# Altium project H2_transmitter_v1.PrjPcb
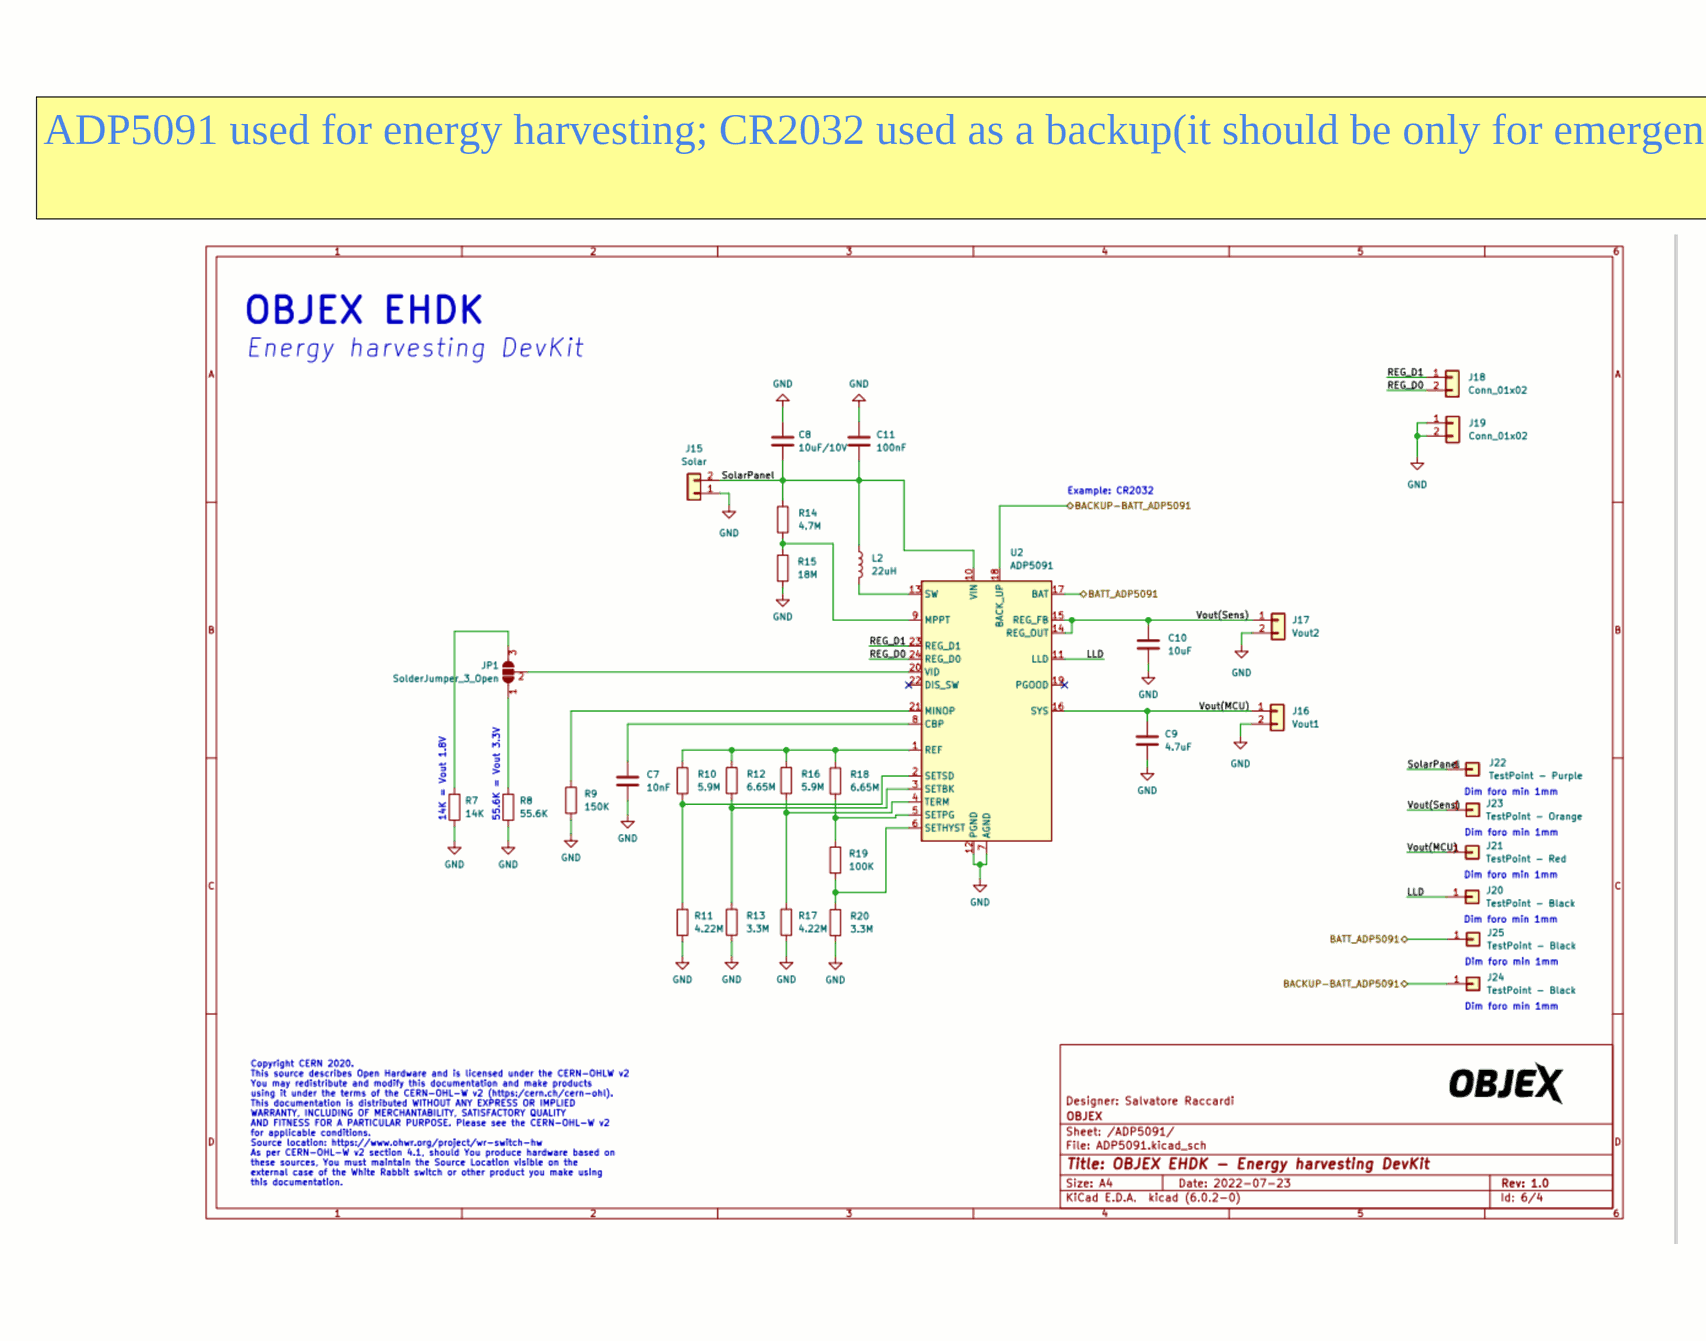
[diagram p0: 1_Power.SchDoc, left]
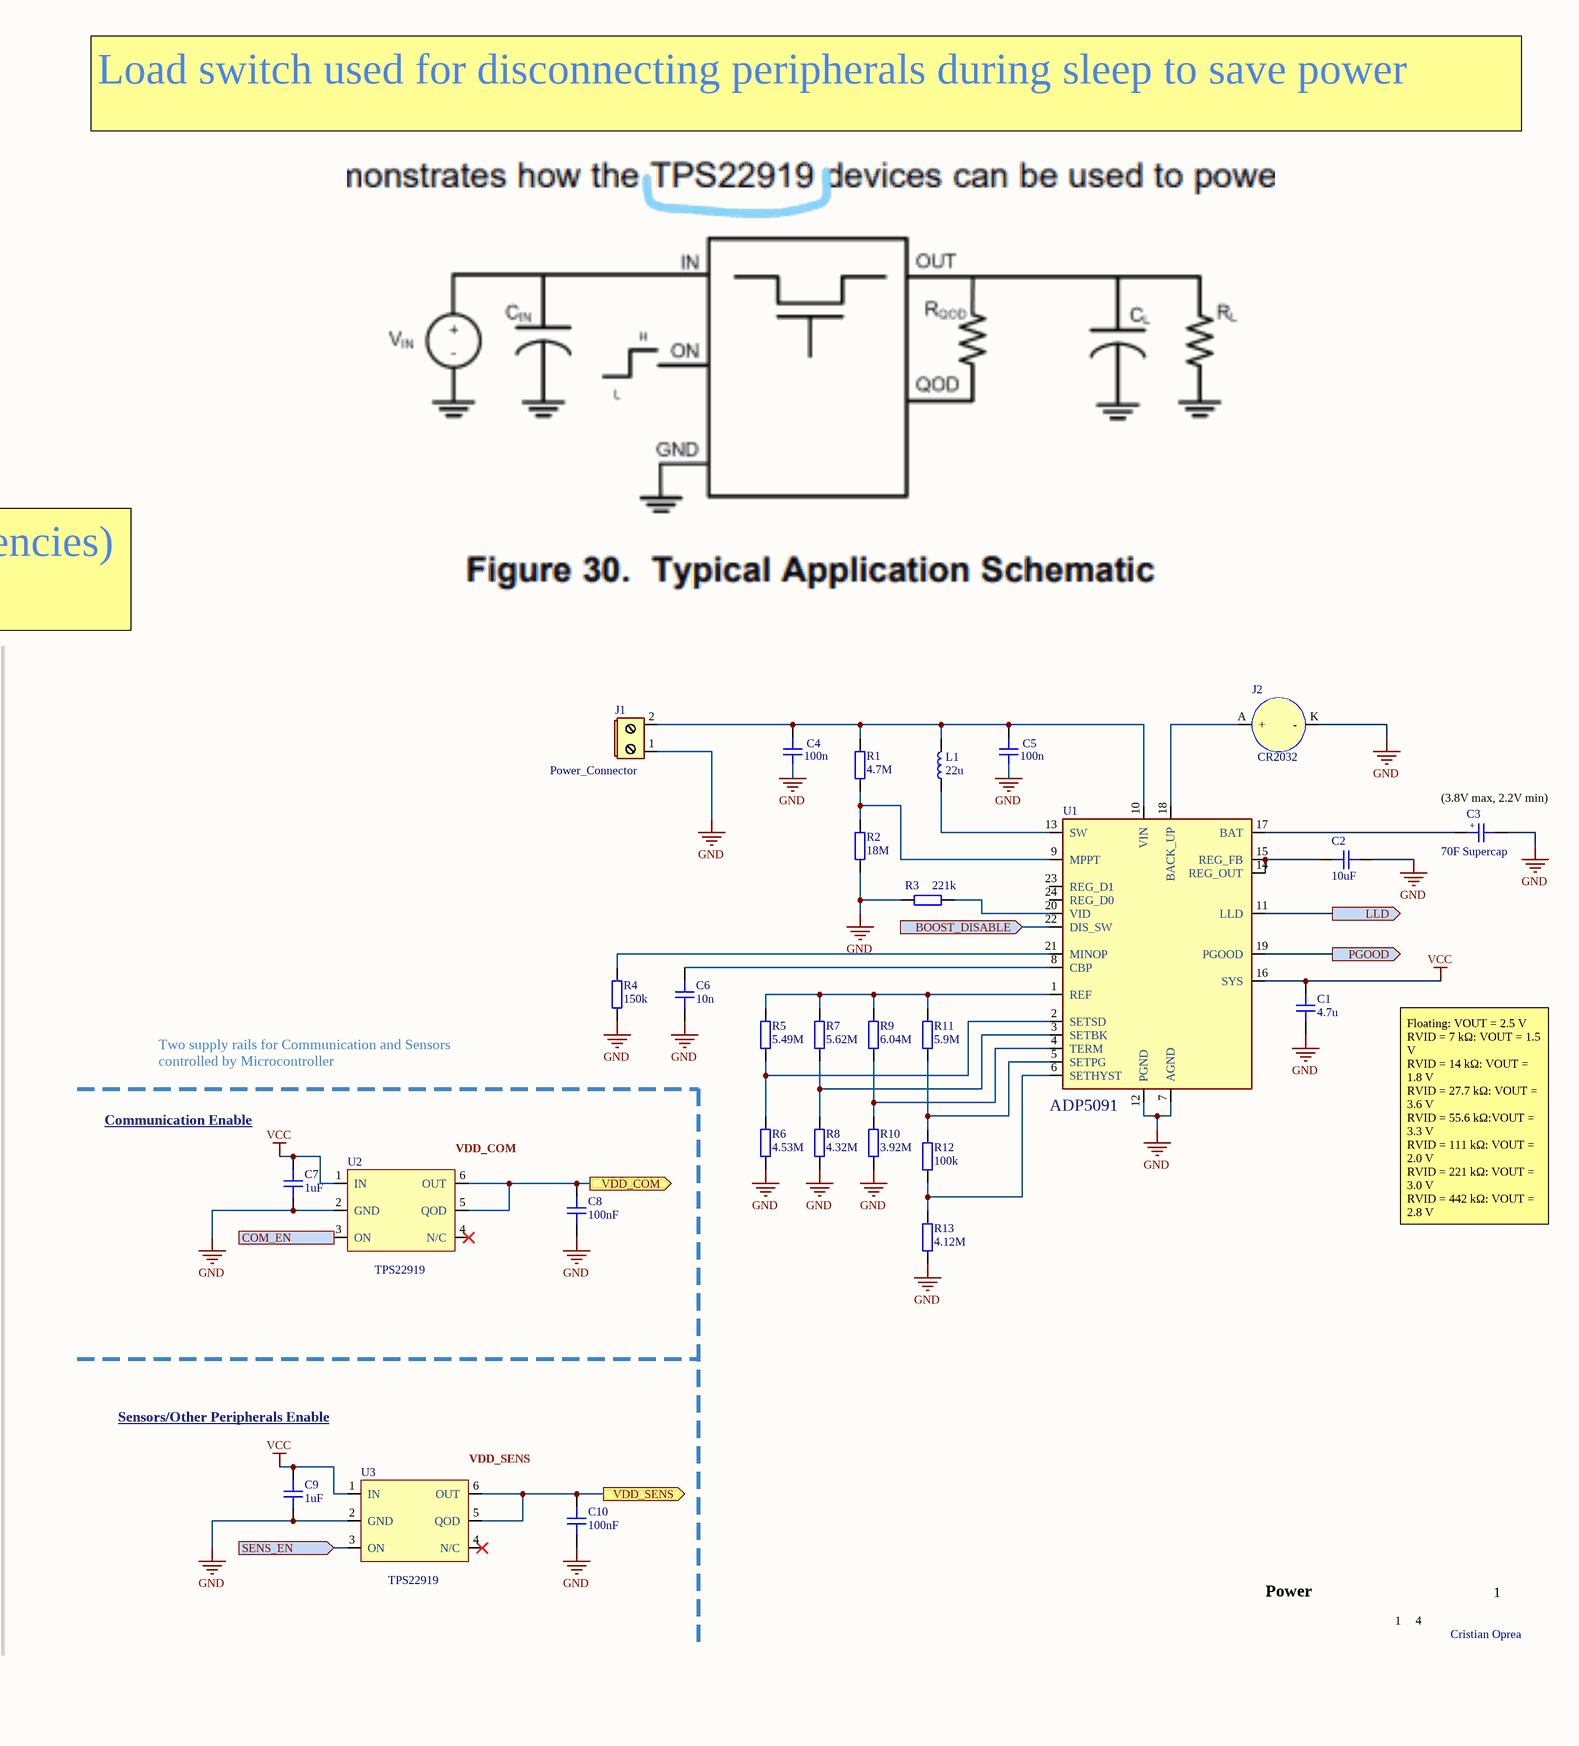
[diagram p1: 1_Power.SchDoc, middle]
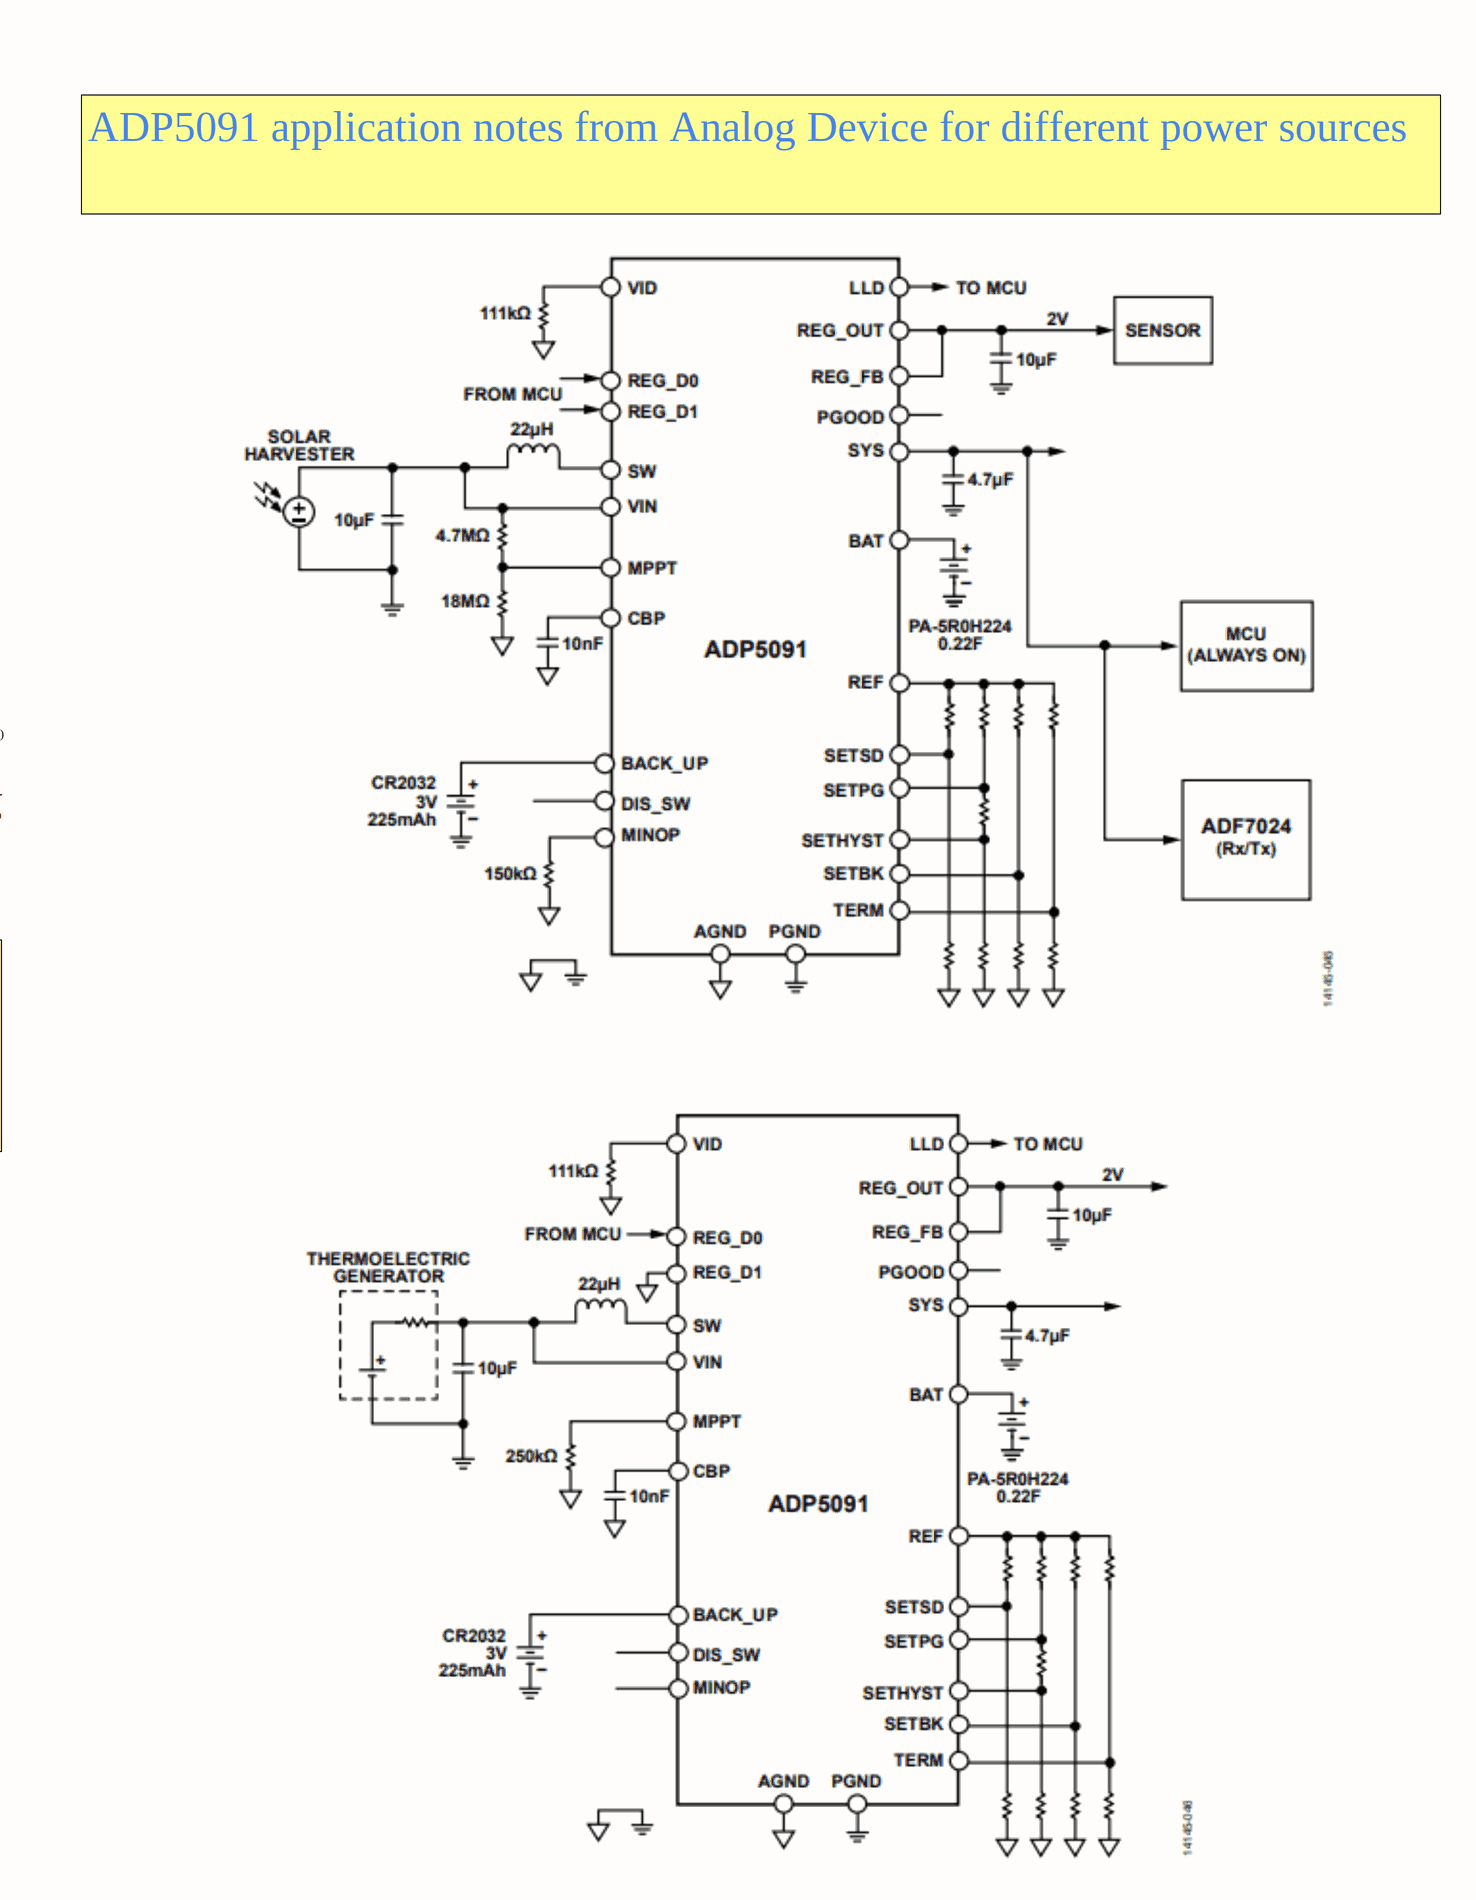
[diagram p2: 1_Power.SchDoc, right]
4 sheets, 53 parts. Net scope: flat (ports and power ports of the same name join across sheets).
Sheets:
  1_Power.SchDoc
  2_Microcontroler.SchDoc
  3_Communication.SchDoc
  4_Modules.SchDoc

## Sheet 1_Power.SchDoc
size A4; SheetNumber: 1; SheetTotal: 4

### Parts
(Parts that share a designator on the sheet are numbered #1, #2 ... from top to bottom, then left to right.)
C1  4.7u  [CAP_0603]
C2  10uF  [CAP_0603]
C3  70F Supercap  [CAP_TANT_0603]
C4  100n  [CAP_0603]
C5  100n  [CAP_0603]
C6  10n  [CAP_0603]
C7  1uF  [CAP_0603]
C8  100nF  [CAP_0603]
C9  1uF  [CAP_0603]
C10  100nF  [CAP_0603]
J1  Power_Connector
J2#1  CR2032  [CR2032]
L1  22u  [IND_1008]
R1  4.7M  [RES_0603]
R2  18M  [RES_0603]
R3  221k  [RES_0603]
R4  150k  [RES_0603]
R5  5.49M  [RES_0603]
R6  4.53M  [RES_0603]
R7  5.62M  [RES_0603]
R8  4.32M  [RES_0603]
R9  6.04M  [RES_0603]
R10  3.92M  [RES_0603]
R11  5.9M  [RES_0603]
R12  100k  [RES_0603]
R13  4.12M  [RES_0603]
U1  ADP5091
U2  TPS22919
U3  TPS22919

### Ports
BOOST_DISABLE (in), COM_EN (in), LLD (out), PGOOD (out), SENS_EN (in), VDD_COM (out), VDD_SENS (out)

### Nets
GND: C1.1 C2.2 C3.K C4.1 C5.1 C6.1 C7.1 C8.1 C9.1 C10.1 J1.1 J2#1.K(-) R2.1 R3.1 R4.1 R6.1 R8.1 R10.1 R13.1 U1.7(AGND) U1.12(PGND) U2.2(GND) U3.2(GND)
VCC: C1.2 C7.2 C9.2 U1.16(SYS) U2.1(IN) U3.1(IN)
NetC2_1: C2.1 U1.14(REG_OUT) U1.15(REG_FB)
NetC3_A: C3.A U1.17(BAT)
NetC4_2: C4.2 C5.2 J1.2 L1.2 R1.2 U1.10(VIN)
NetC6_2: C6.2 U1.8(CBP)
NetC8_2: C8.2 U2.5(QOD) U2.6(OUT) ; port VDD_COM
NetC10_2: C10.2 U3.5(QOD) U3.6(OUT) ; port VDD_SENS
NetJ2#1_A: J2#1.A(+) U1.18(BACK_UP)
NetL1_1: L1.1 U1.13(SW)
NetR1_1: R1.1 R2.2 U1.9(MPPT)
NetR3_2: R3.2 U1.20(VID)
NetR4_2: R4.2 U1.21(MINOP)
NetR5_1: R5.1 R6.2 U1.2(SETSD)
NetR5_2: R5.2 R7.2 R9.2 R11.2 U1.1(REF)
NetR7_1: R7.1 R8.2 U1.3(SETBK)
NetR9_1: R9.1 R10.2 U1.4(TERM)
NetR11_1: R11.1 R12.2 U1.5(SETPG)
NetR12_1: R12.1 R13.2 U1.6(SETHYST)
NetU1_11: U1.11(LLD) ; port LLD
NetU1_19: U1.19(PGOOD) ; port PGOOD
NetU1_22: U1.22(DIS_SW) ; port BOOST_DISABLE
NetU2_3: U2.3(ON) ; port COM_EN
NetU3_3: U3.3(ON) ; port SENS_EN

Not connected (* = marked no-connect by the designer): U1 23(REG_D1) 24(REG_D0); U2 4(N/C)*; U3 4(N/C)*

### Notes on the sheet
- Load switch used for disconnecting peripherals during sleep to save power
- ADP5091 application notes from Analog Device for different power sources
- ADP5091 used for energy harvesting; CR2032 used as a backup(it should be only for emergencies)
- R1 not populated for TEG generators
- (near C3) (3.8V max, 2.2V min)
- VID resistor for setting output voltage
- Low Light Density (low voltage at input), PGOOD is HIGH only when output voltage is higher than the set voltage
- Two supply rails for Communication and Sensors controlled by Microcontroller
- Communication Enable
- (near U2) VDD_COM
- Vsetsd = 2.2V (stop discharge threshold) (hybrid supercapacitor with lithium)
- Vsetbk = 2.3V (backup supply swith on threshold)(higher than stop discharge threshold)
- (near R12) Vbat_term = 3.8V (stop charge threshold) (hybrid supercapacitor with lithium)
- (near R12) Vsetbkhys = (hysteresis threshold)
- Floating: VOUT = 2.5 V
  RVID = 7 kΩ: VOUT = 1.5 V
  RVID = 14 kΩ: VOUT = 1.8 V
  RVID = 27.7 kΩ: VOUT = 3.6 V
  RVID = 55.6 kΩ:VOUT = 3.3 V
  RVID = 111 kΩ: VOUT = 2.0 V
  RVID = 221 kΩ: VOUT = 3.0 V
  RVID = 442 kΩ: VOUT = 2.8 V
- (near R13) Vsetpg = 2.4V (power good threshold) (voltage output is higher than this threshold)
- Sensors/Other Peripherals Enable
- (near U3) VDD_SENS
- Power
- 1
- 4
- Cristian Oprea
- (in symbol Supercapacitor) +

### Library data of the parts
C1 C2 C4-C10 = CAP_0603: Capacitor SMD 0603; Manufacturer: *; Manufacturer Part Number: *; Distributor Link: *; LCSC: *; Rating: *; Dielectric: *
C3 = Supercapacitor: Manufacturer: *; Manufacturer Part Number: *; Distributor Link: *; LCSC: *
J1 = Power_Connector: Screw terminal or plug terminal for power
J2#1 = CR2032-BS-6-1: CR2032 Coin Cell Battery Holder; Manufacturer: Q&J; Manufacturer Part Number: CR2032-BS-6-1
L1 = IND_1008: Inductor SMD 1008
R1-R13 = RES_0603: Resistor SMD 0603; Manufacturer: *; Manufacturer Part Number: *; Distributor Link: *; LCSC: *
U1 = ADP5091: Ultralow Power Energy Harvester PMUs / with MPPT and Charge Management and BAckup Supply
U2 U3 = TPS22919: 5.5-V, 1.5-A, 90-mΩ load switch with adjustable output discharge

## Sheet 2_Microcontroler.SchDoc
size A4; SheetNumber: 2; SheetTotal: 4
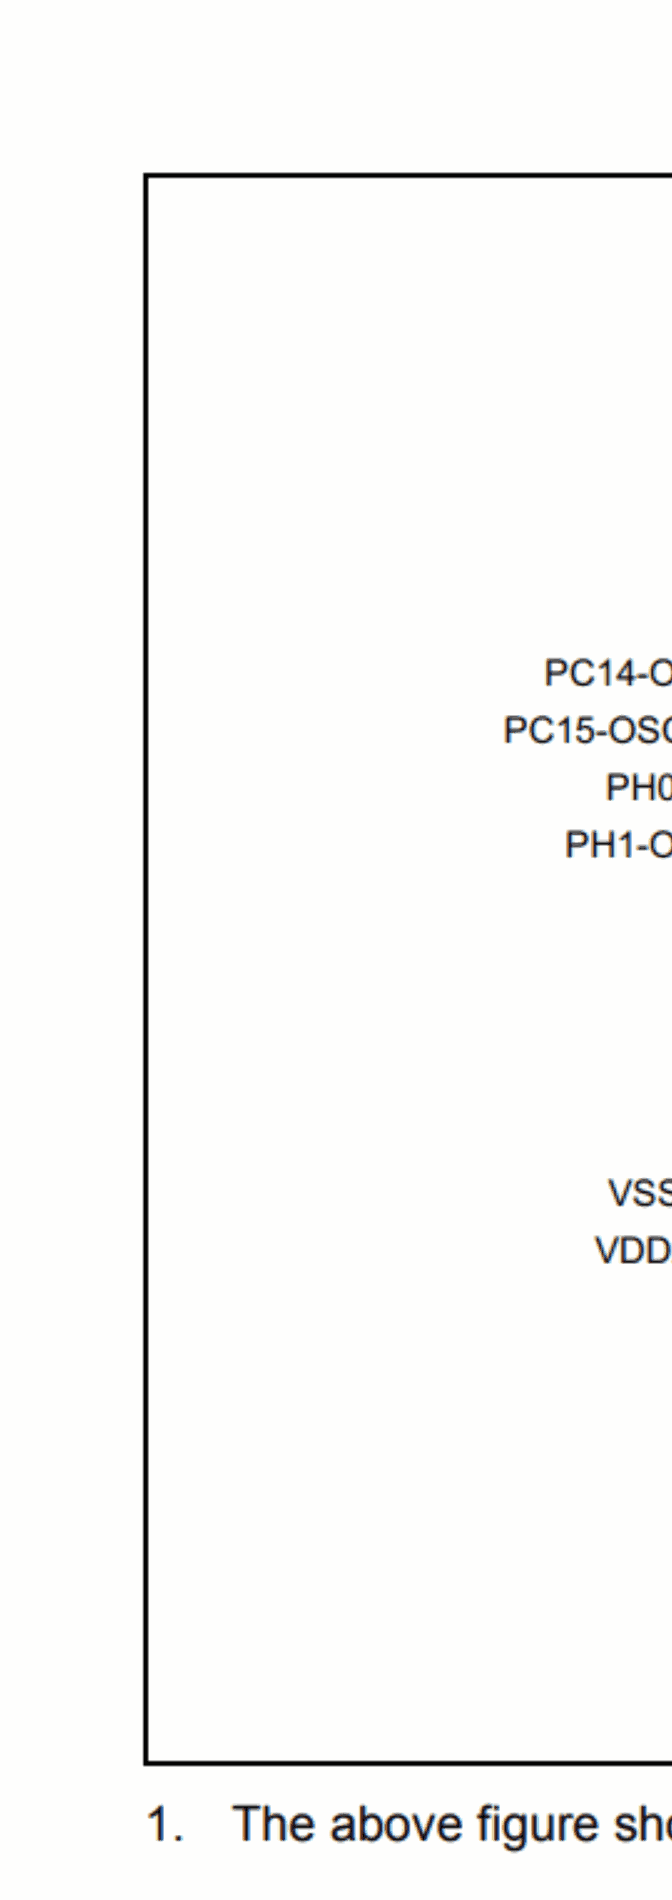
[diagram p3: 2_Microcontroler.SchDoc, top left]
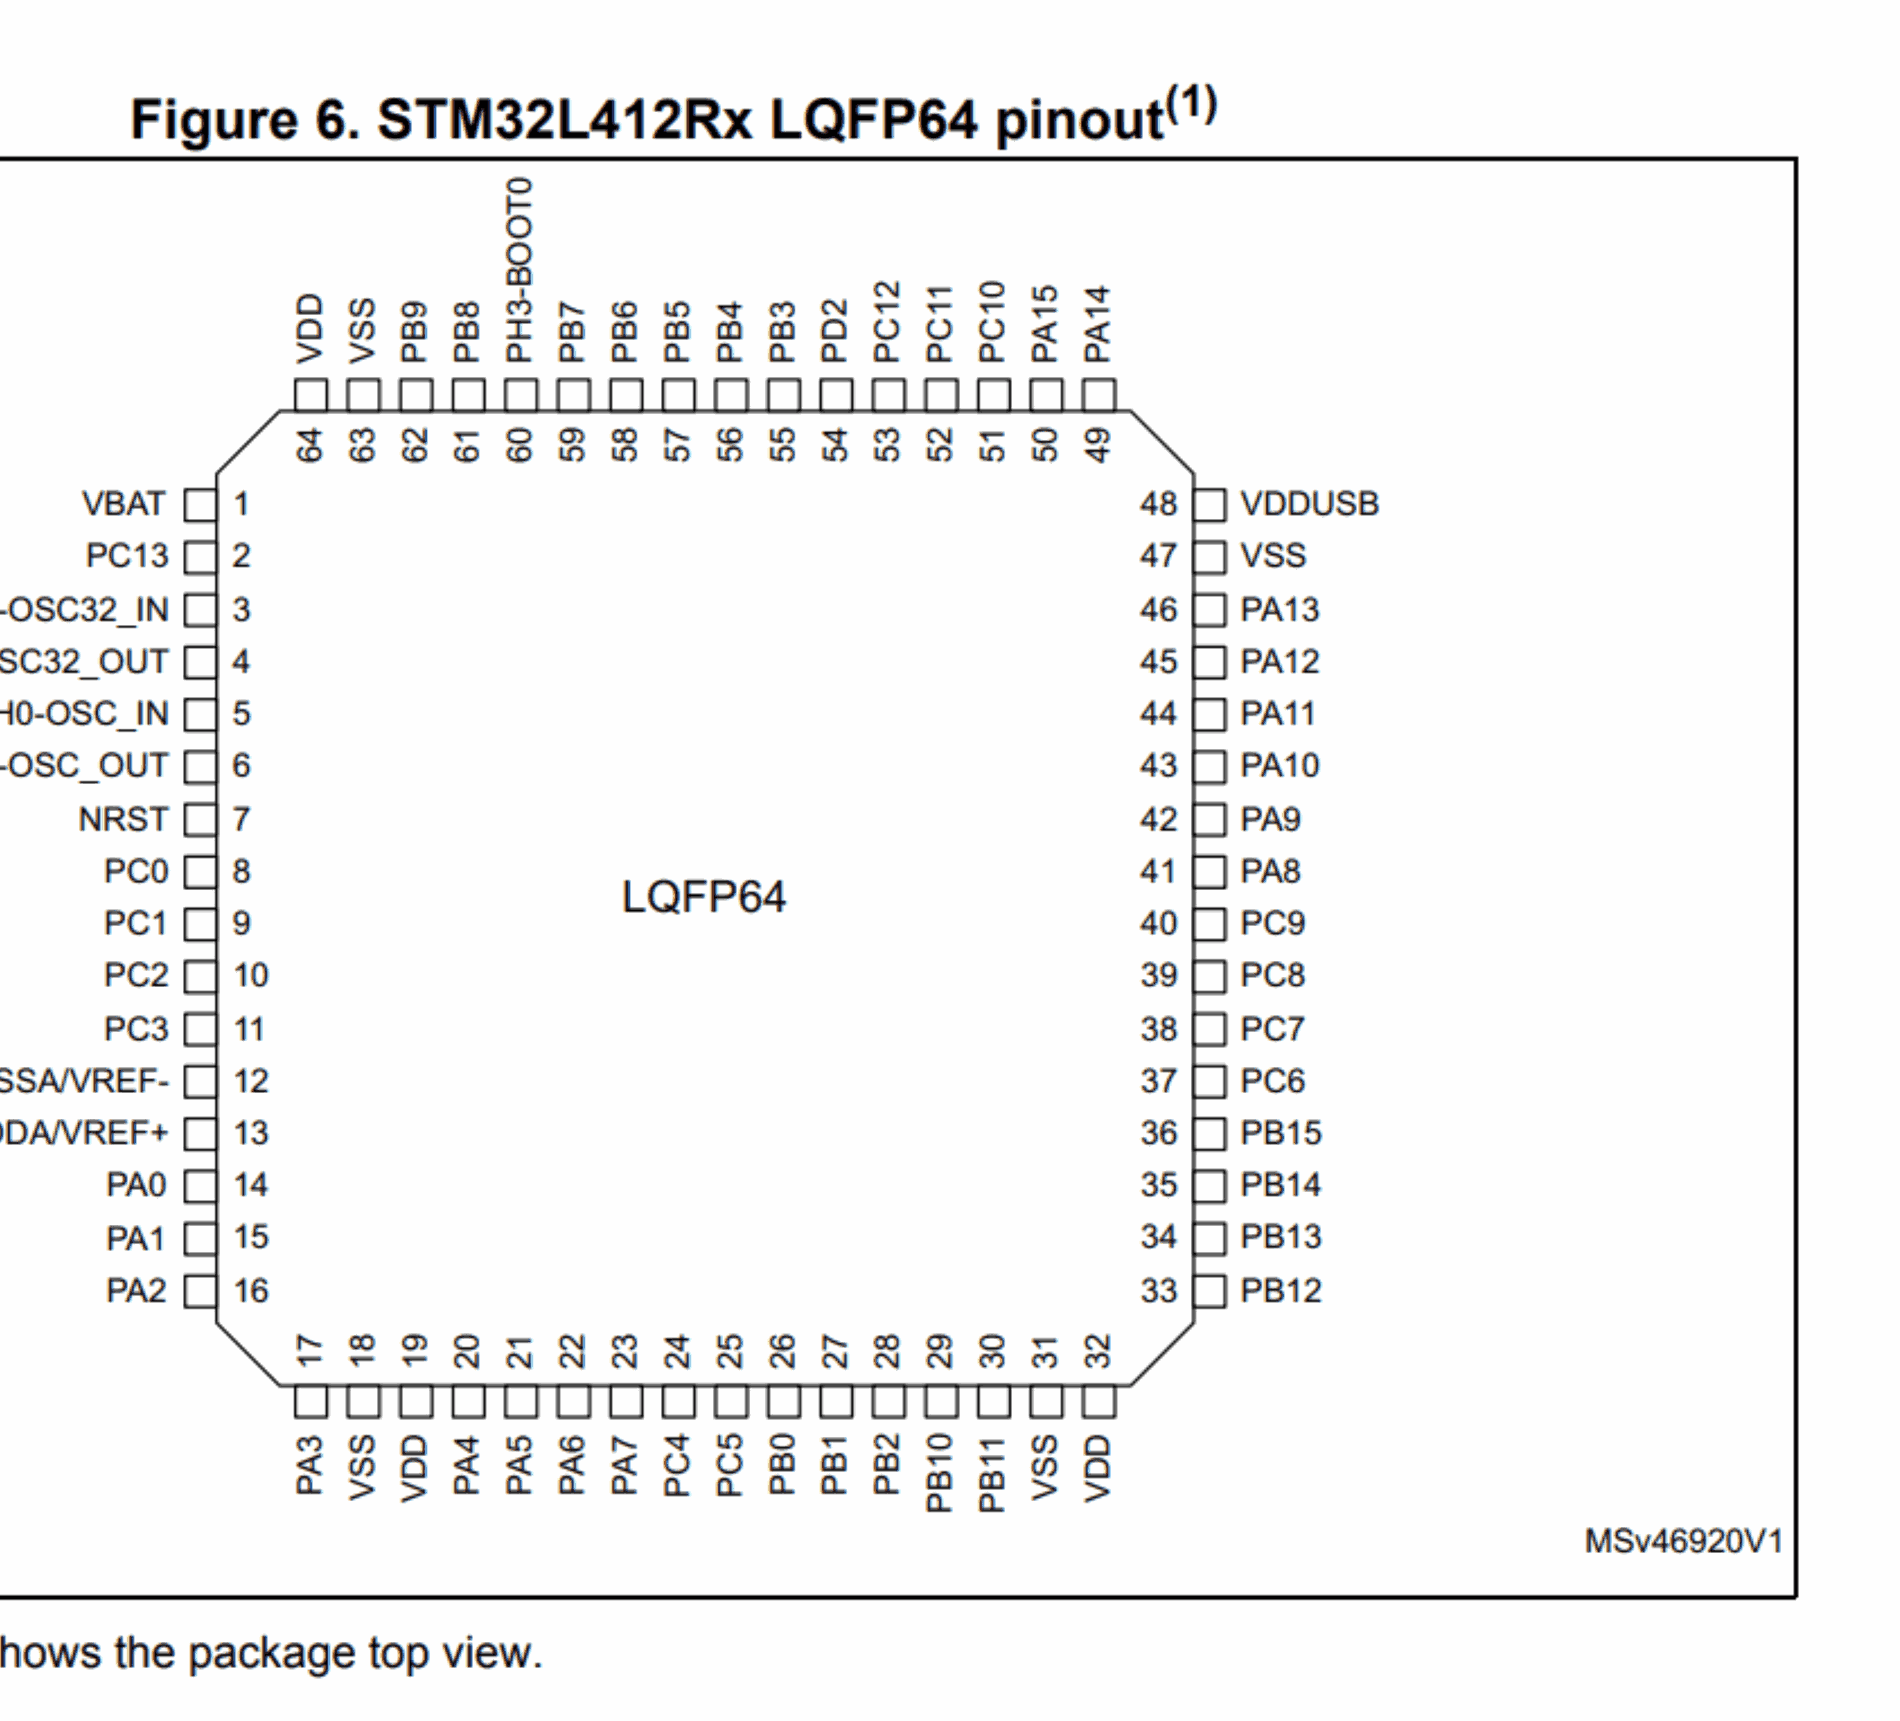
[diagram p4: 2_Microcontroler.SchDoc, top middle]
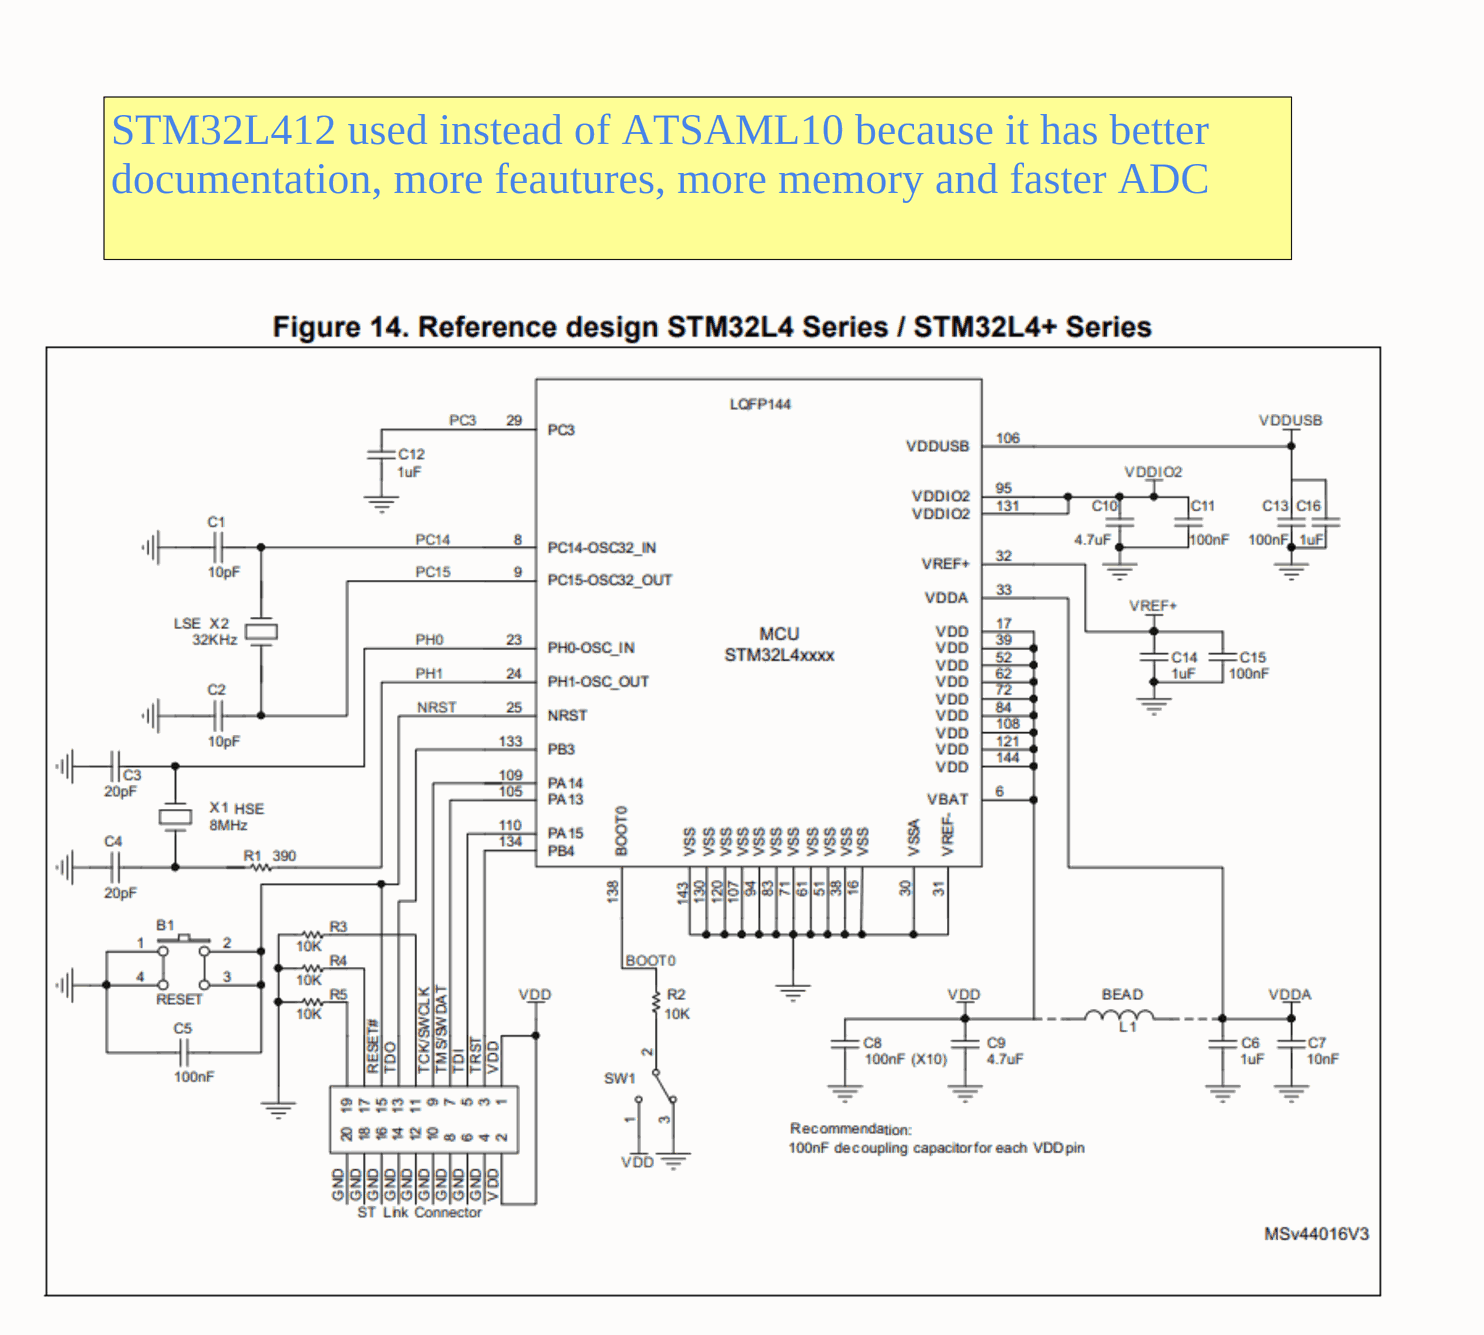
[diagram p5: 2_Microcontroler.SchDoc, bottom left]
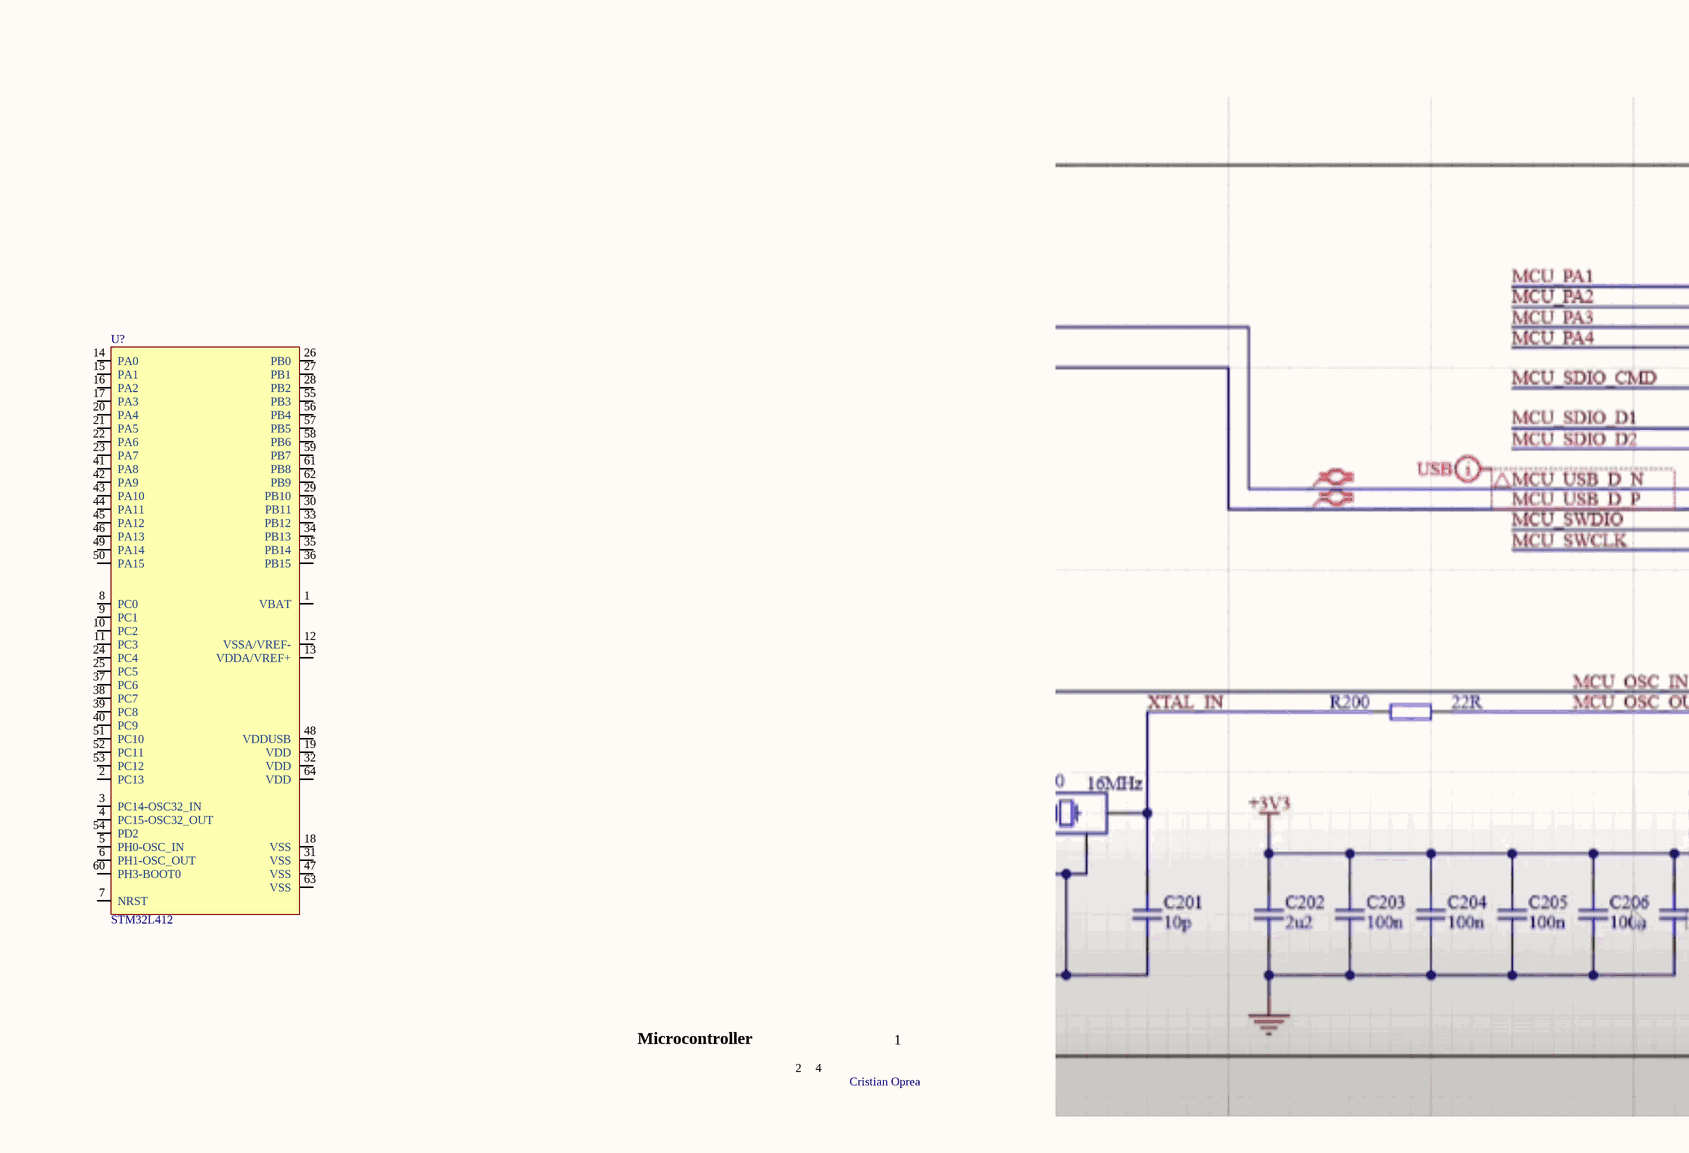
[diagram p6: 2_Microcontroler.SchDoc, bottom middle]
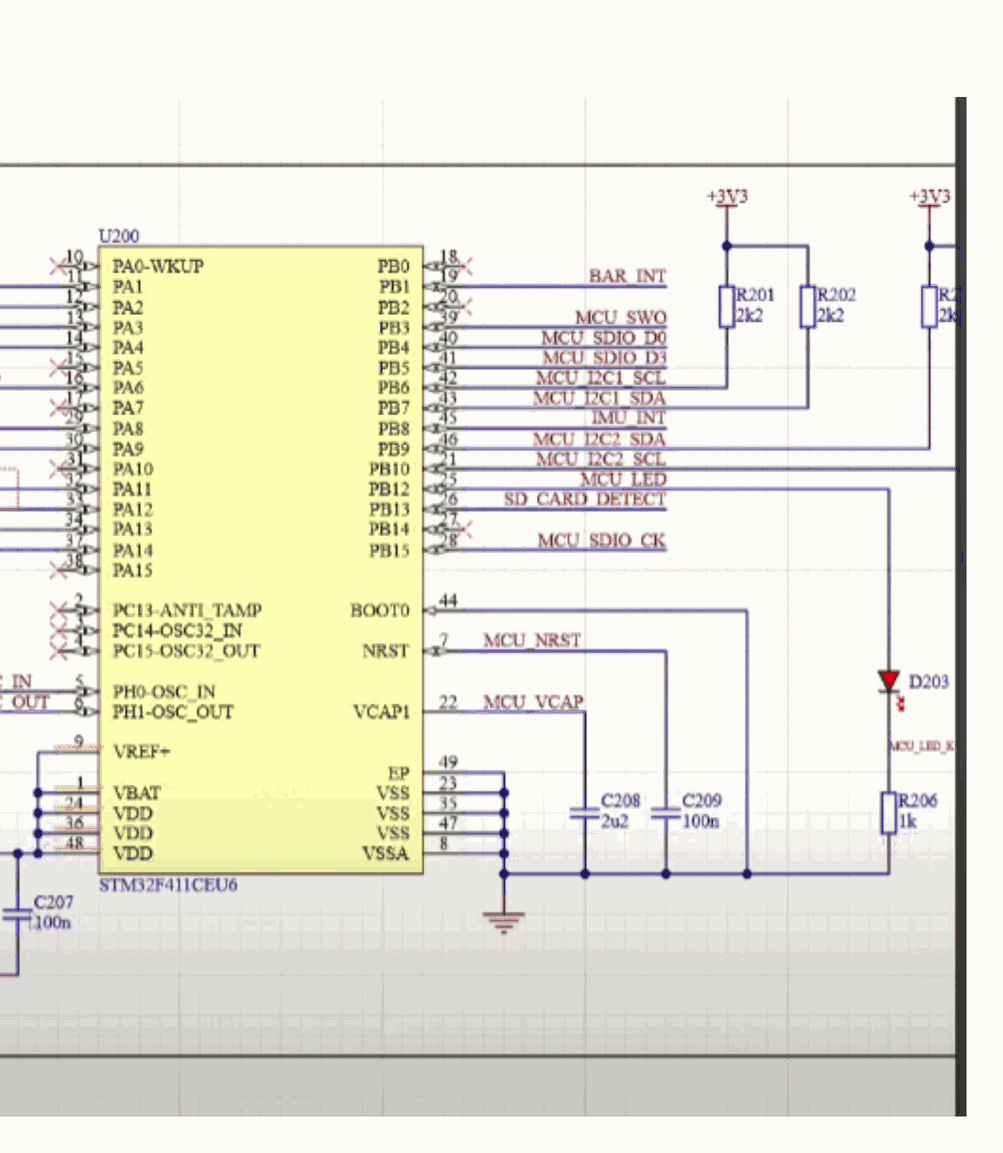
[diagram p7: 2_Microcontroler.SchDoc, bottom right]

### Parts
U?  STM32L412

### Nets

Not connected (* = marked no-connect by the designer): U? 1(VBAT) 2(PC13) 3(PC14-OSC32_IN) 4(PC15-OSC32_OUT) 5(PH0-OSC_IN) 6(PH1-OSC_OUT) 7(NRST) 8(PC0) 9(PC1) 10(PC2) 11(PC3) 12(VSSA/VREF-) 13(VDDA/VREF+) 14(PA0) 15(PA1) 16(PA2) 17(PA3) 18(VSS) 19(VDD) 20(PA4) 21(PA5) 22(PA6) 23(PA7) 24(PC4) 25(PC5) 26(PB0) 27(PB1) 28(PB2) 29(PB10) 30(PB11) 31(VSS) 32(VDD) 33(PB12) 34(PB13) 35(PB14) 36(PB15) 37(PC6) 38(PC7) 39(PC8) 40(PC9) 41(PA8) 42(PA9) 43(PA10) 44(PA11) 45(PA12) 46(PA13) 47(VSS) 48(VDDUSB) 49(PA14) 50(PA15) 51(PC10) 52(PC11) 53(PC12) 54(PD2) 55(PB3) 56(PB4) 57(PB5) 58(PB6) 59(PB7) 60(PH3-BOOT0) 61(PB8) 62(PB9) 63(VSS) 64(VDD)

### Notes on the sheet
- STM32L412 used instead of ATSAML10 because it has better documentation, more feautures, more memory and faster ADC
- Microcontroller
- 2
- 4
- 1
- Cristian Oprea

### Library data of the parts
U? = STM32L412: Ultra-low-power Arm® Cortex®-M4 32-bit MCU+FPU, 100DMIPS, / up to 128KB flash, 40KB SRAM(LQFP64)

## Sheet 3_Communication.SchDoc
size A4; SheetNumber: 3; SheetTotal: 4
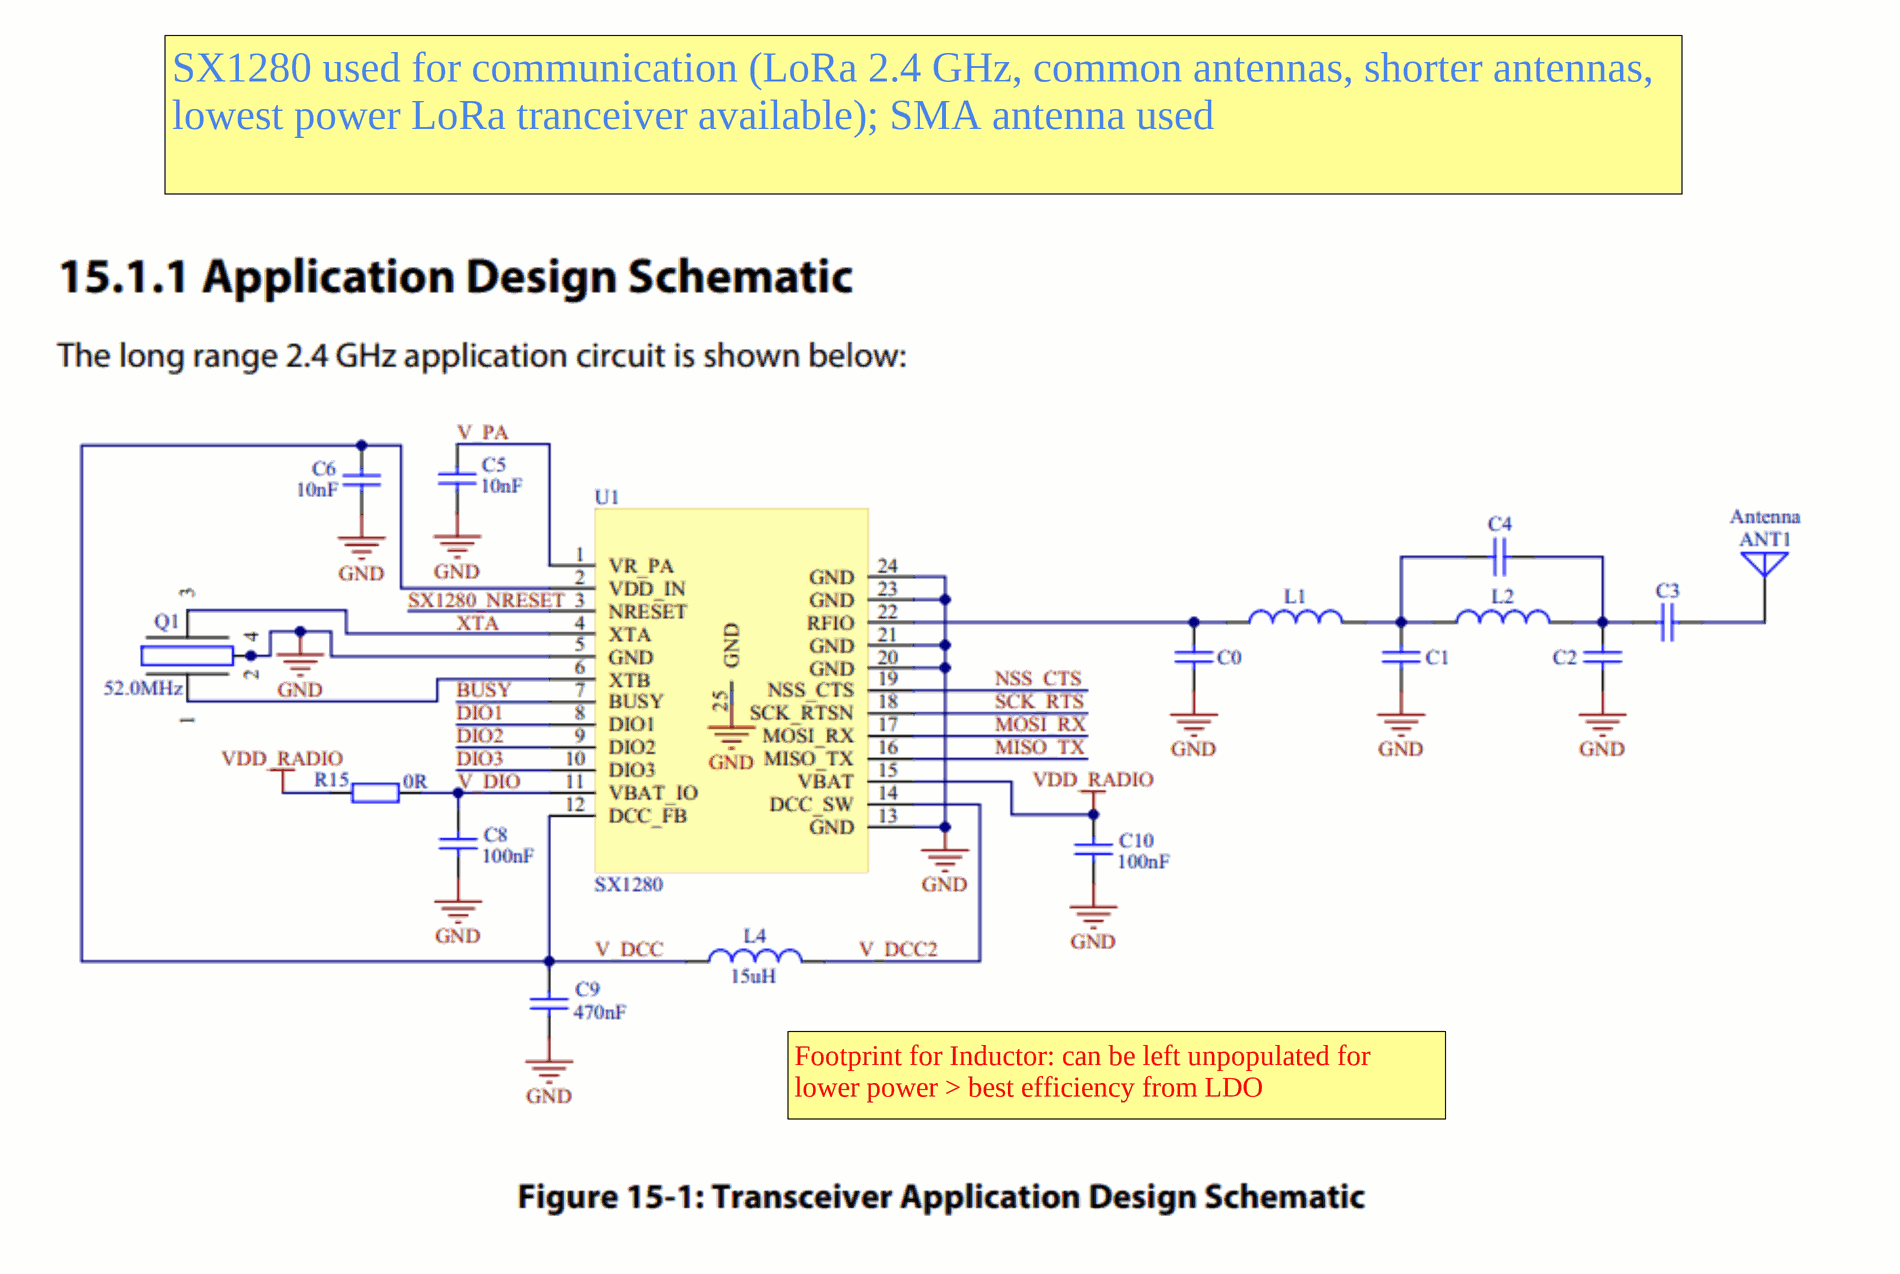
[diagram p8: 3_Communication.SchDoc, left]
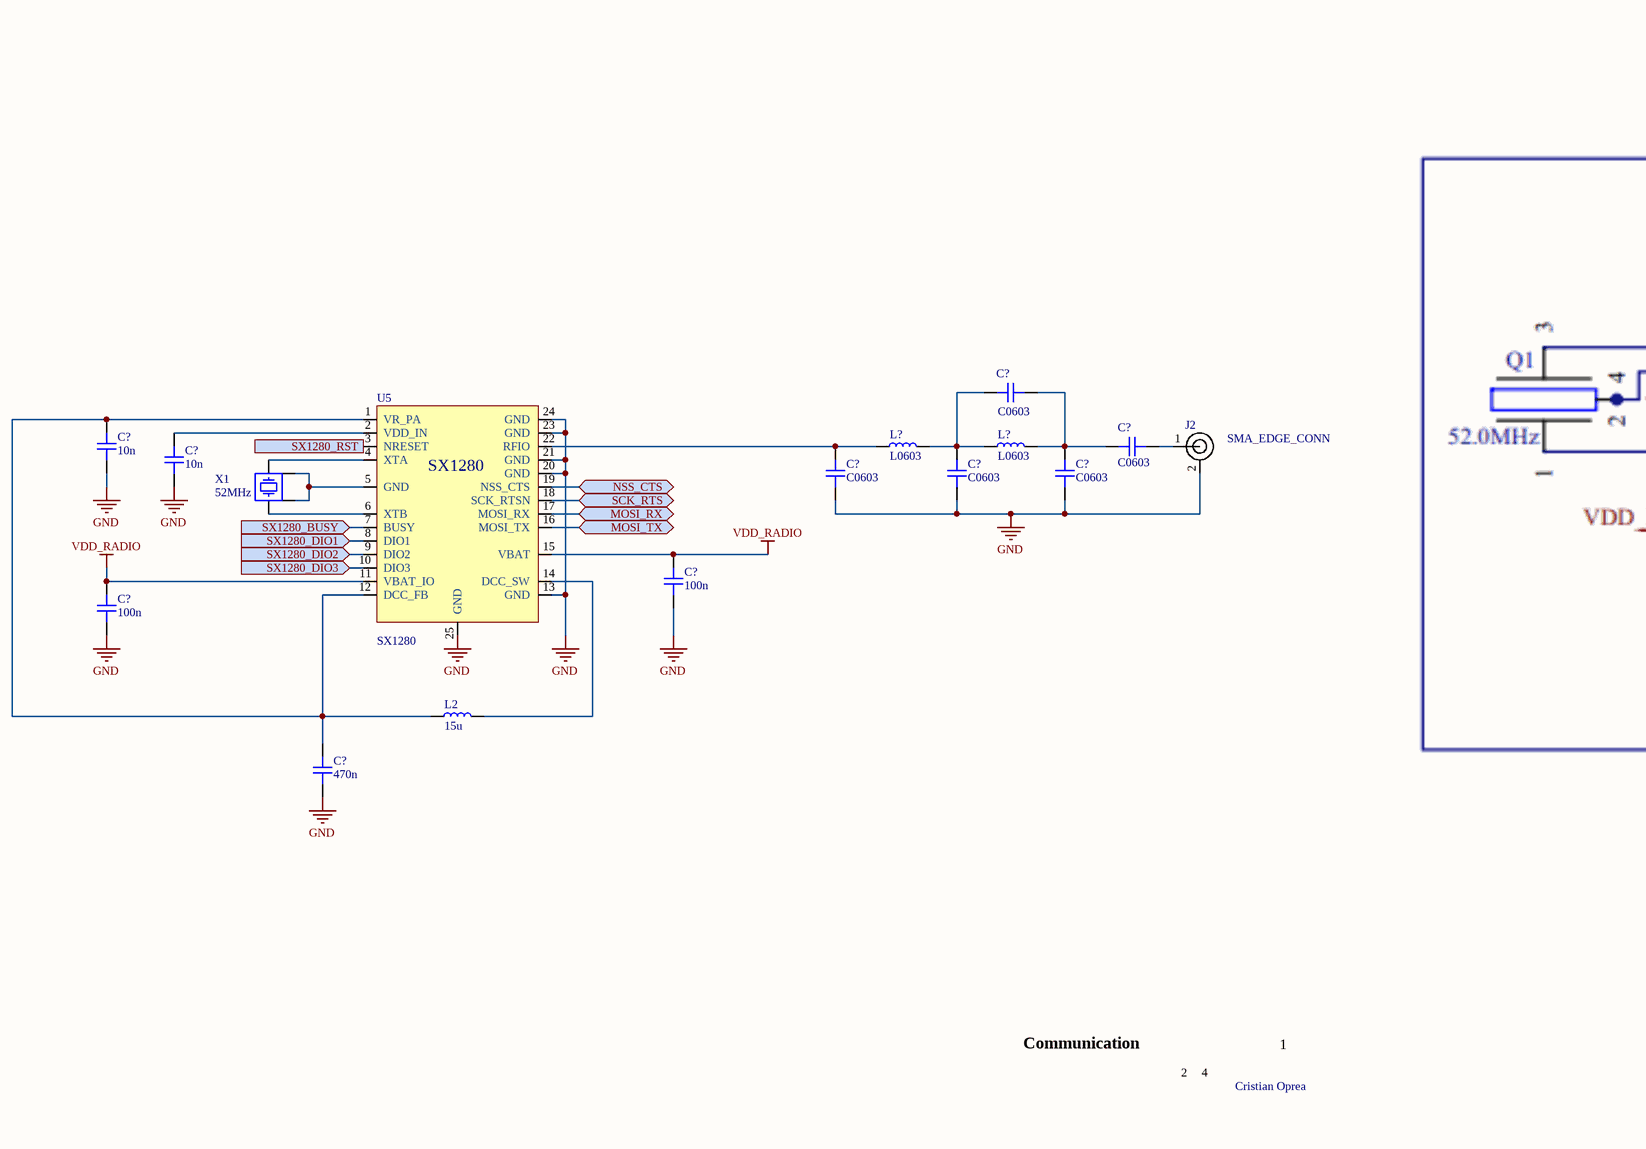
[diagram p9: 3_Communication.SchDoc, middle]
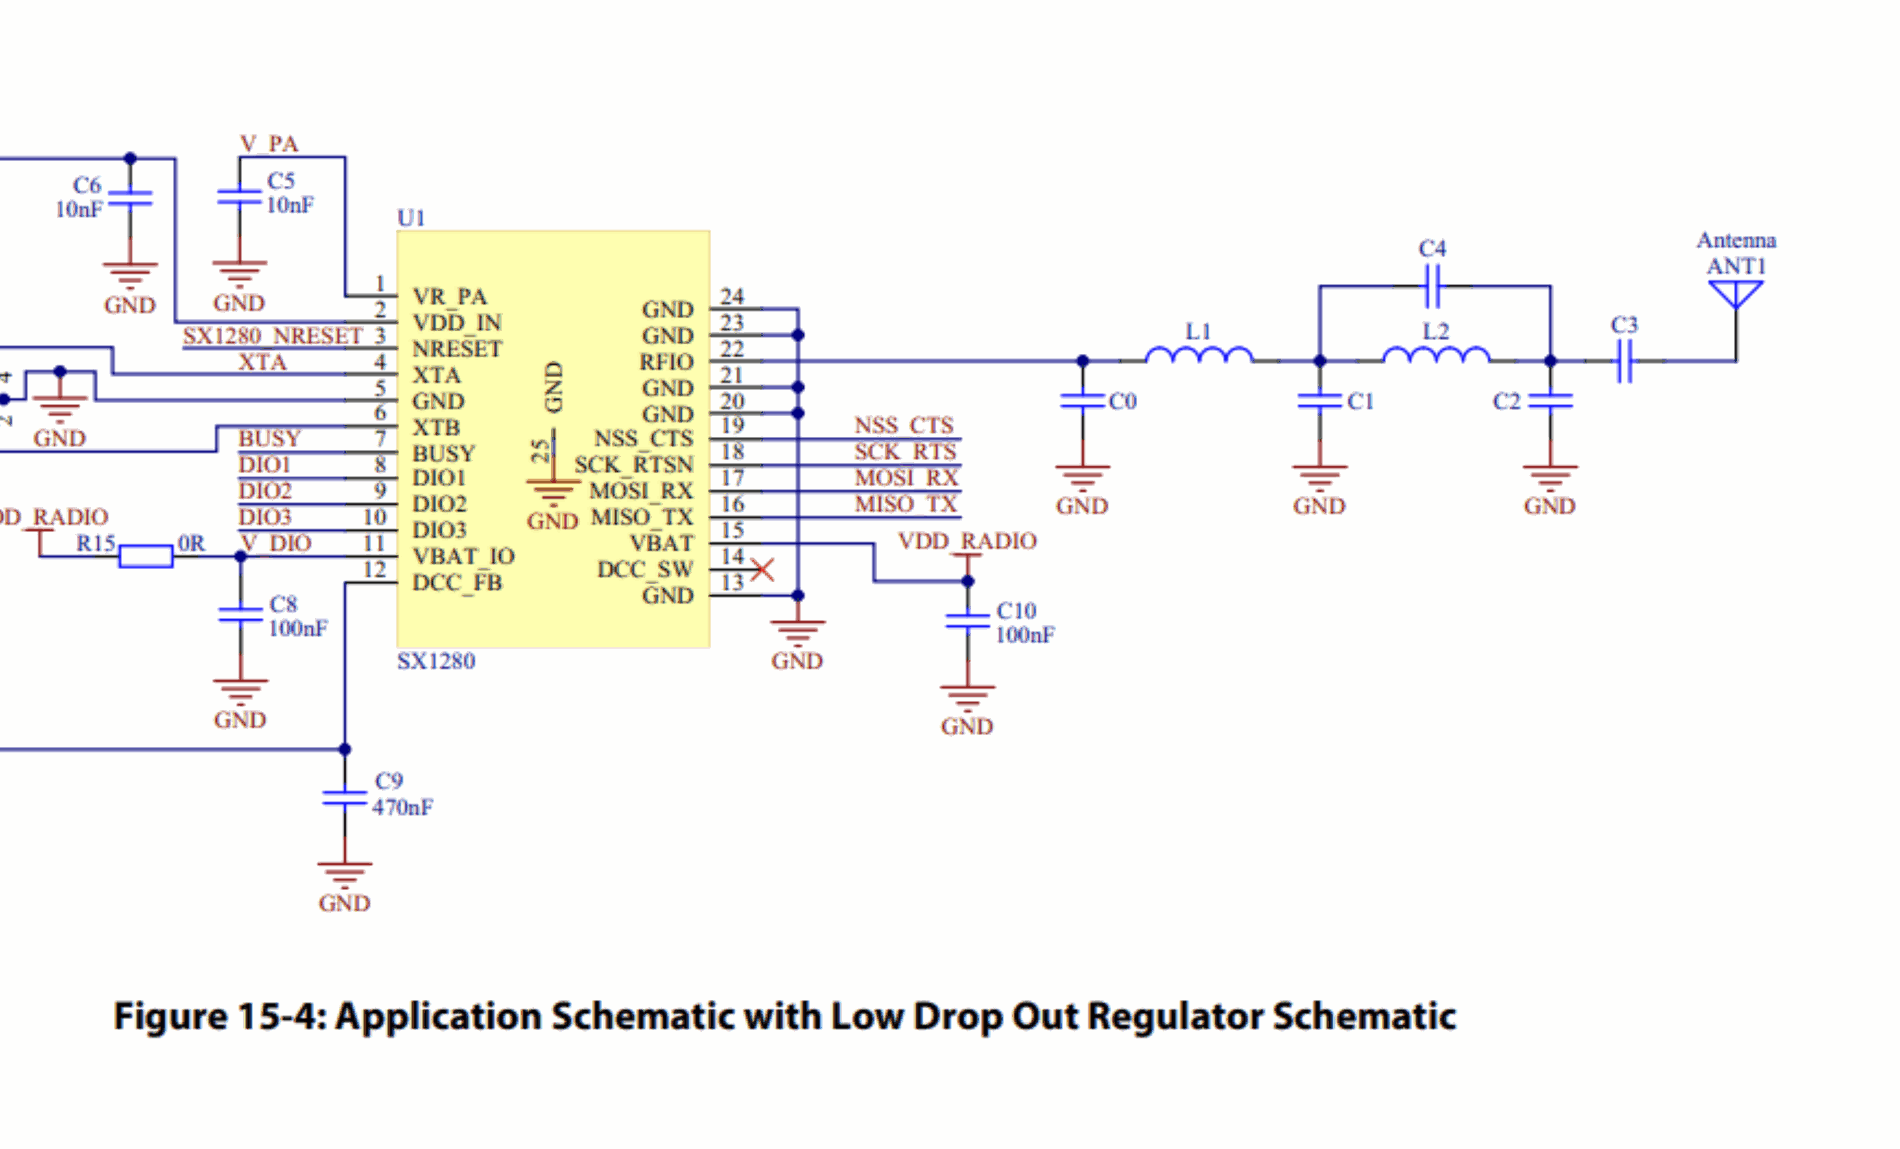
[diagram p10: 3_Communication.SchDoc, right]

### Parts
(Parts that share a designator on the sheet are numbered #1, #2 ... from top to bottom, then left to right.)
C?#1  C0603  [CAP_0603]
C?#2  10n  [CAP_0603]
C?#3  C0603  [CAP_0603]
C?#4  10n  [CAP_0603]
C?#5  C0603  [CAP_0603]
C?#6  C0603  [CAP_0603]
C?#7  C0603  [CAP_0603]
C?#8  100n  [CAP_0603]
C?#9  100n  [CAP_0603]
C?#10  470n  [CAP_0603]
J2#2  SMA_EDGE_CONN  [CON-SMA-EDGE-S]
L2  15u  [IND_0603]
L?#1  L0603  [IND_0603]
L?#2  L0603  [IND_0603]
U5  SX1280
X1  52MHz  [XTAL_3225]

### Ports
MOSI_RX (bidir), MOSI_TX (bidir), NSS_CTS (bidir), SCK_RTS (bidir), SX1280_BUSY (in), SX1280_DIO1 (in), SX1280_DIO2 (in), SX1280_DIO3 (in), SX1280_RST (in)

### Nets
GND: C?#2.1 C?#4.1 C?#5.1 C?#6.1 C?#7.1 C?#8.1 C?#9.1 C?#10.1 J2#2.2 U5.13(GND) U5.20(GND) U5.21(GND) U5.23(GND) U5.24(GND) U5.25(GND)
VDD_RADIO: C?#8.2 C?#9.2 U5.11(VBAT_IO) U5.15(VBAT)
NetC?#1_1: C?#1.1 C?#3.2 C?#7.2 L?#2.2
NetC?#1_2: C?#1.2 C?#6.2 L?#1.2 L?#2.1
NetC?#2_2: C?#2.2 C?#10.2 L2.1 U5.1(VR_PA) U5.12(DCC_FB)
NetC?#3_1: C?#3.1 J2#2.1
NetC?#4_2: C?#4.2 U5.2(VDD_IN)
NetC?#5_2: C?#5.2 L?#1.1 U5.22(RFIO)
NetL2_2: L2.2 U5.14(DCC_SW)
NetU5_3: U5.3(NRESET) ; port SX1280_RST
NetU5_4: U5.4(XTA) X1.3
NetU5_5: U5.5(GND) X1.2 X1.4
NetU5_6: U5.6(XTB) X1.1
NetU5_7: U5.7(BUSY) ; port SX1280_BUSY
NetU5_8: U5.8(DIO1) ; port SX1280_DIO1
NetU5_9: U5.9(DIO2) ; port SX1280_DIO2
NetU5_10: U5.10(DIO3) ; port SX1280_DIO3
NetU5_16: U5.16(MOSI_TX) ; port MOSI_TX
NetU5_17: U5.17(MOSI_RX) ; port MOSI_RX
NetU5_18: U5.18(SCK_RTSN) ; port SCK_RTS
NetU5_19: U5.19(NSS_CTS) ; port NSS_CTS

### Notes on the sheet
- SX1280 used for communication (LoRa 2.4 GHz, common antennas, shorter antennas, lowest power LoRa tranceiver available); SMA antenna used
- Values based on antenna input imedance
- Footprint for Inductor: can be left unpopulated for lower power > best efficiency from LDO
- Communication
- 2
- 4
- 1
- Cristian Oprea

### Library data of the parts
C?#1-C?#10 = CAP_0603: Capacitor SMD 0603; Manufacturer: *; Manufacturer Part Number: *; Distributor Link: *; LCSC: *; Rating: *; Dielectric: *
J2#2 = CON-SMA-EDGE-S: RF Connector SMA Female 50 Ohms 18 GHz PCB Edge Mount; Manufacturer: RF Solutions; Manufacturer Part Number: CON-SMA-EDGE-S
L2 L?#1 L?#2 = IND_0603: Inductor SMD 0603
U5 = SX1280: Low power LoRa transceiver operating at 2.4GHz with ranging capability
X1 = Crystal: Manufacturer: Epson; Manufacturer Part Number: TSX-3225 24.0000MF15X-AC

## Sheet 4_Modules.SchDoc
size A4; SheetNumber: 4; SheetTotal: 4
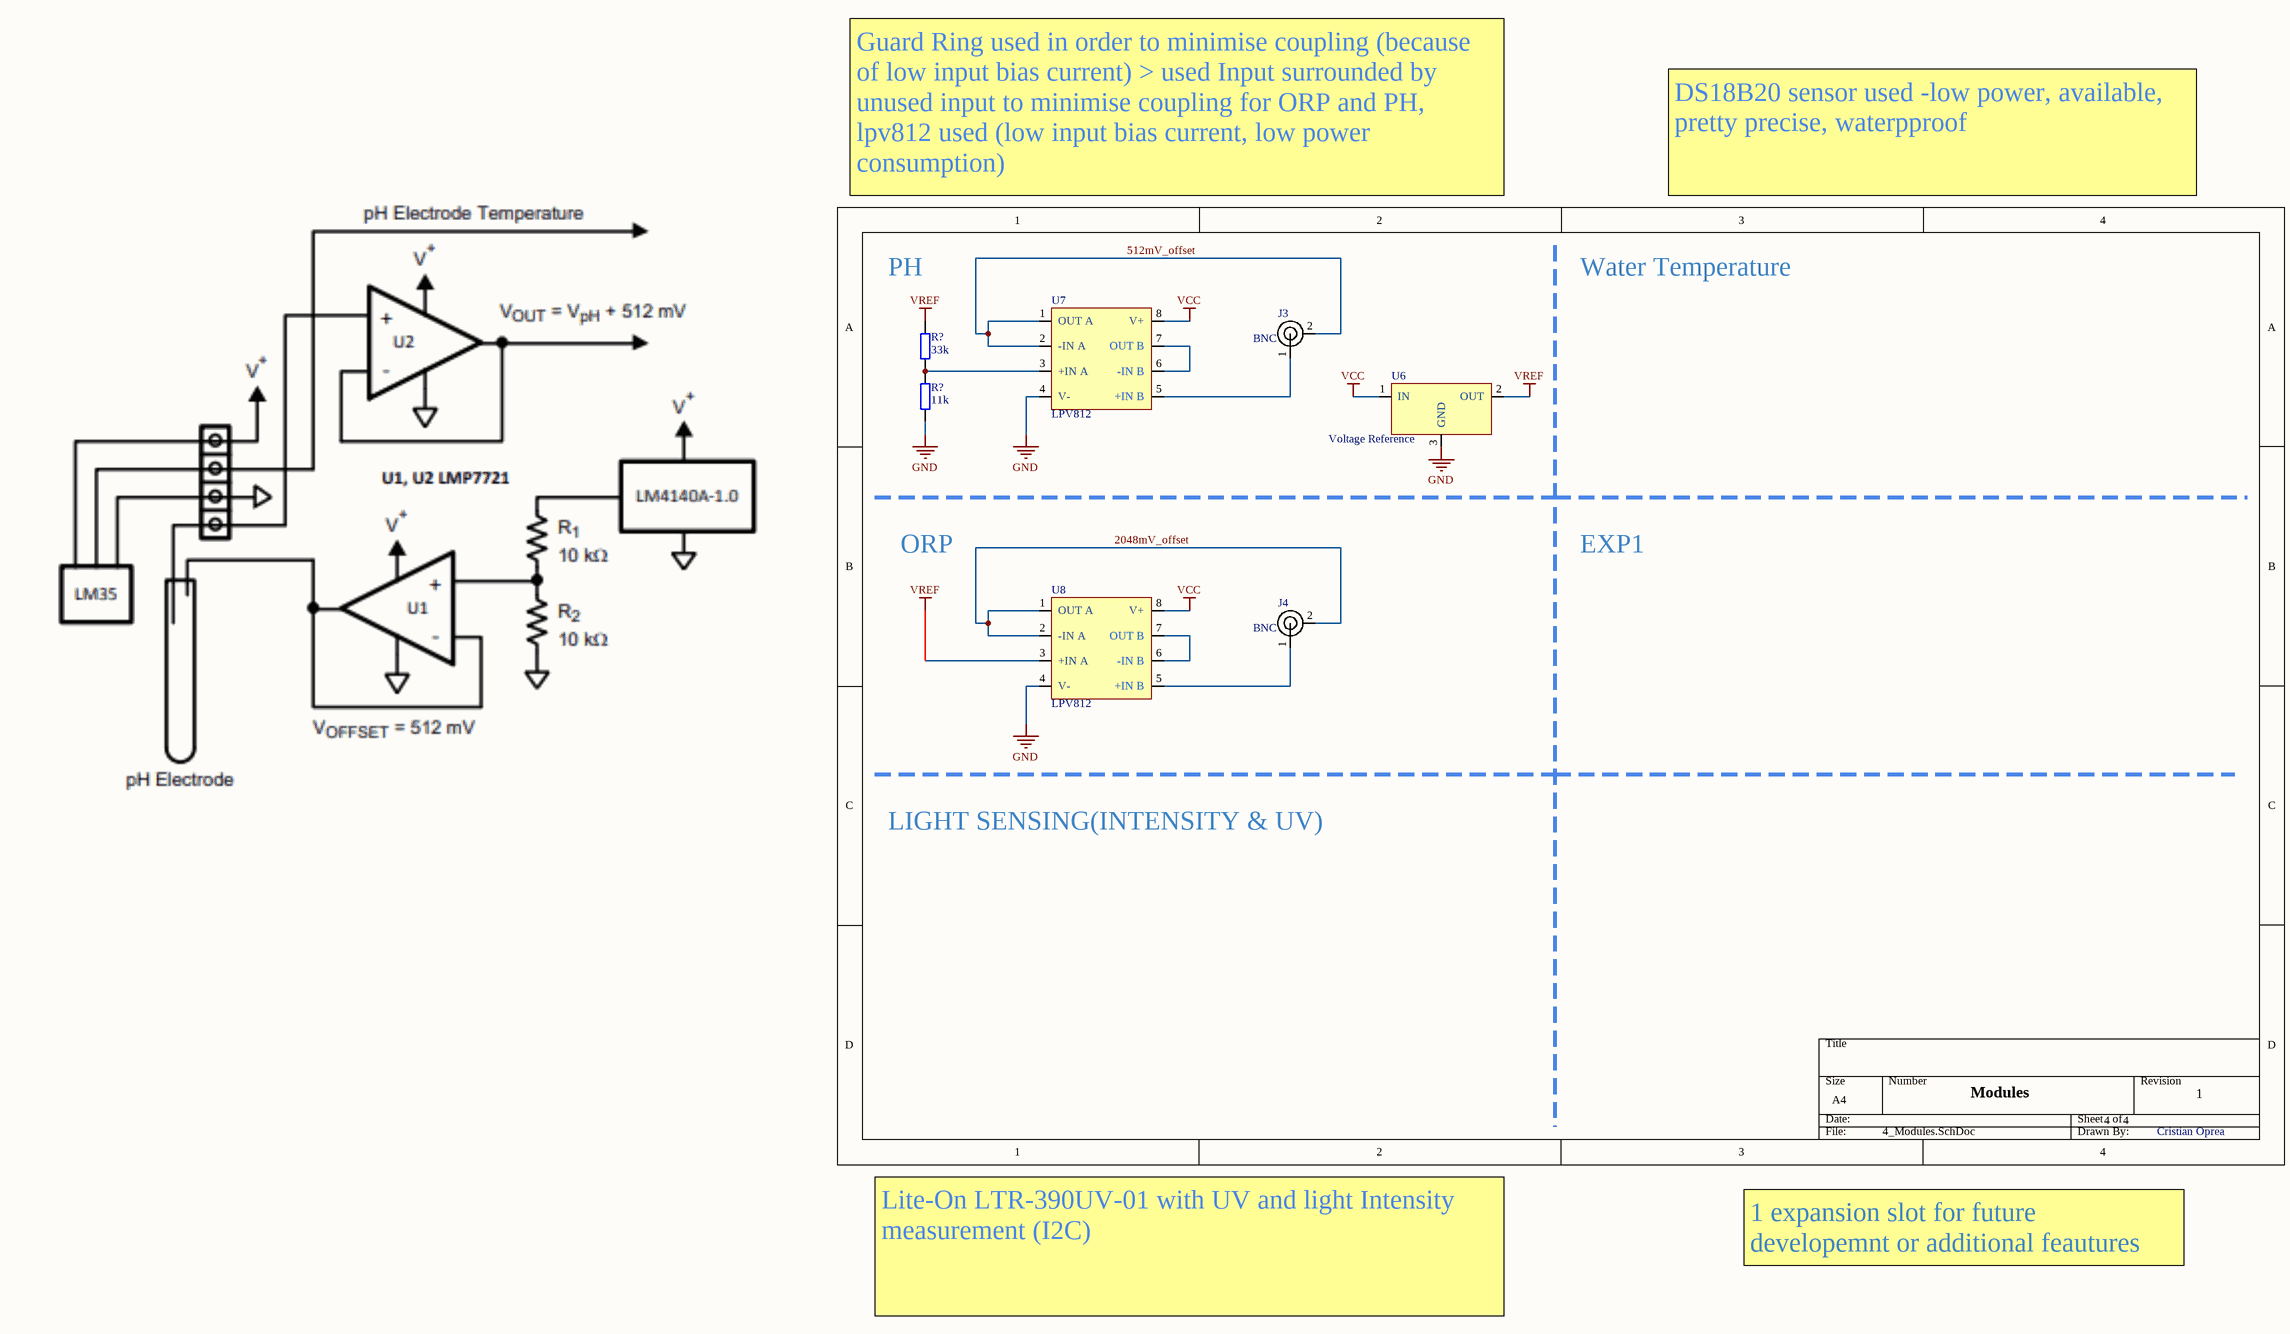
[diagram p11: 4_Modules.SchDoc]

### Parts
(Parts that share a designator on the sheet are numbered #1, #2 ... from top to bottom, then left to right.)
J3  BNC  [U.FL-R-SMT-1(60)]
J4  BNC  [U.FL-R-SMT-1(60)]
R?#1  33k  [RES_0603]
R?#2  11k  [RES_0603]
U6  Voltage Reference  [SOT-23-3]
U7  LPV812
U8  LPV812

### Nets
GND: R?#2.1 U6.3(GND) U7.4(V-) U8.4(V-)
VCC: U6.1(IN) U7.8(V+) U8.8(V+)
VREF: R?#1.2 U6.2(OUT) U8.3(+IN_A)
512mV_offset: J3.2 U7.1(OUT_A) U7.2(-IN_A)
2048mV_offset: J4.2 U8.1(OUT_A) U8.2(-IN_A)
NetJ3_1: J3.1 U7.5(+IN_B)
NetJ4_1: J4.1 U8.5(+IN_B)
NetR?#1_1: R?#1.1 R?#2.2 U7.3(+IN_A)
NetU7_6: U7.6(-IN_B) U7.7(OUT_B)
NetU8_6: U8.6(-IN_B) U8.7(OUT_B)

### Notes on the sheet
- Guard Ring used in order to minimise coupling (because of low input bias current) > used Input surrounded by unused input to minimise coupling for ORP and PH, lpv812 used (low input bias current, low power consumption)
- DS18B20 sensor used -low power, available, pretty precise, waterpproof
- PH
- Water Temperature
- ORP
- EXP1
- LIGHT SENSING(INTENSITY & UV)
- Modules
- 4
- 1
- Cristian Oprea
- Lite-On LTR-390UV-01 with UV and light Intensity measurement (I2C)
- 1 expansion slot for future developemnt or additional feautures

### Library data of the parts
J3 J4 = U.FL-R-SMT-1(60): RF Connector BNC; Manufacturer: Hirose Connector; Manufacturer Part Number: U.FL-R-SMT-1(60)
R?#1 R?#2 = RES_0603: Resistor SMD 0603; Manufacturer: *; Manufacturer Part Number: *; Distributor Link: *; LCSC: *
U6 = VREF: Voltage References 2.048 Low-Cost, Micropower, Low-Dropout, High-Output-Current, SOT23; Manufacturer: Maxim Integrated; Manufacturer Part Number: MAX6101EUR+T
U7 U8 = LPV812: Dual Channel 425nA Precision Nanopower Operational Amplifiers

## Nets that join several sheets
GND: 1_Power (23 pins), 3_Communication (15 pins), 4_Modules (R?#2.1 U6.3 U7.4 U8.4)
VCC: 1_Power (6 pins), 4_Modules (U6.1 U7.8 U8.8)